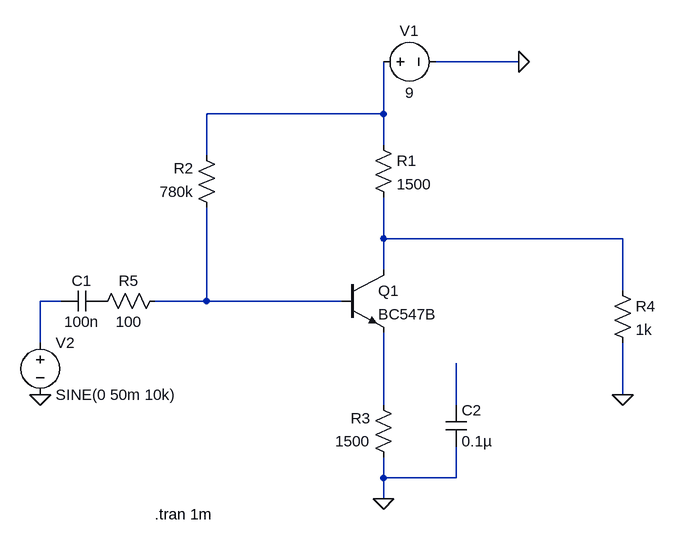
[diagram p0: schematic Autopolarizacion en base.asc]
Autopolarizacion en base.asc, the LTspice schematic file:
Version 4
SHEET 1 880 680
WIRE 448 -272 320 -272
WIRE 240 -192 240 -272
WIRE 240 -192 -32 -192
WIRE 240 -144 240 -192
WIRE -32 -128 -32 -192
WIRE 240 0 240 -64
WIRE 608 0 240 0
WIRE 240 48 240 0
WIRE 608 80 608 0
WIRE -256 96 -288 96
WIRE -32 96 -32 -48
WIRE -32 96 -112 96
WIRE 176 96 -32 96
WIRE -288 160 -288 96
WIRE 608 240 608 160
WIRE 240 256 240 144
WIRE 352 256 352 192
WIRE 240 368 240 336
WIRE 352 368 352 320
WIRE 352 368 240 368
WIRE 240 400 240 368
FLAG 240 400 0
FLAG 448 -272 0
FLAG 608 240 0
FLAG -288 240 0
SYMBOL npn 176 48 R0
SYMATTR InstName Q1
SYMATTR Value BC547B
SYMBOL res 224 -160 R0
SYMATTR InstName R1
SYMATTR Value 1500
SYMBOL res -16 -32 R180
WINDOW 0 36 76 Left 2
WINDOW 3 36 40 Left 2
SYMATTR InstName R2
SYMATTR Value 780k
SYMBOL res 256 352 R180
WINDOW 0 36 76 Left 2
WINDOW 3 36 40 Left 2
SYMATTR InstName R3
SYMATTR Value 1500
SYMBOL voltage 224 -272 R270
WINDOW 0 32 56 VTop 2
WINDOW 3 -32 56 VBottom 2
WINDOW 123 0 0 Left 0
WINDOW 39 0 0 Left 0
SYMATTR InstName V1
SYMATTR Value 9
SYMBOL voltage -288 144 R0
WINDOW 123 0 0 Left 0
WINDOW 39 0 0 Left 0
SYMATTR InstName V2
SYMATTR Value SINE(0 50m 10k)
SYMBOL res -96 80 R90
WINDOW 0 0 56 VBottom 2
WINDOW 3 32 56 VTop 2
SYMATTR InstName R5
SYMATTR Value 100
SYMBOL res 592 64 R0
SYMATTR InstName R4
SYMATTR Value 1k
SYMBOL cap -192 80 R90
WINDOW 0 0 32 VBottom 2
WINDOW 3 32 32 VTop 2
SYMATTR InstName C1
SYMATTR Value 100n
SYMBOL cap 336 256 R0
SYMATTR InstName C2
SYMATTR Value 0.1µ
TEXT -112 424 Left 2 !.tran 1m

The netlist it stands for:
* Autopolarizacion en base.asc
Q1 N002 N004 N005 0 BC547B
R1 N001 N002 1500
R2 N004 N001 780k
R3 0 N005 1500
V1 N001 0 9
V2 N003 0 SINE(0 50m 10k)
R5 N004 P001 100
R4 N002 0 1k
C1 P001 N003 100n
C2 N006 0 0.1µ
.model NPN NPN
.model PNP PNP
.lib standard.bjt
.tran 1m
.backanno
.end